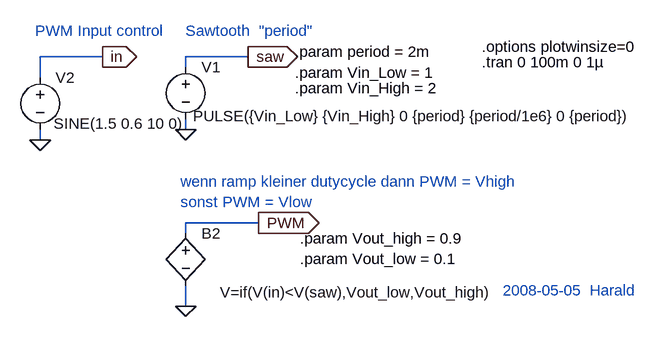
[diagram p0: schematic pwm_idea.asc]
pwm_idea.asc, the LTspice schematic file:
Version 4
SHEET 1 1276 680
WIRE -896 -320 -992 -320
WIRE -672 -320 -768 -320
WIRE -768 -304 -768 -320
WIRE -992 -288 -992 -320
WIRE -768 -208 -768 -224
WIRE -992 -192 -992 -208
WIRE -656 -64 -768 -64
WIRE -768 -48 -768 -64
WIRE -768 64 -768 32
FLAG -768 -208 0
FLAG -672 -320 saw
IOPIN -672 -320 Out
FLAG -656 -64 PWM
IOPIN -656 -64 Out
FLAG -992 -192 0
FLAG -896 -320 in
IOPIN -896 -320 Out
FLAG -768 64 0
SYMBOL voltage -768 -320 R0
WINDOW 3 11 91 Left 0
WINDOW 123 0 0 Left 0
WINDOW 39 0 0 Left 0
SYMATTR Value PULSE({Vin_Low} {Vin_High} 0 {period} {period/1e6} 0 {period})
SYMATTR InstName V1
SYMBOL voltage -992 -304 R0
WINDOW 123 0 0 Left 0
WINDOW 39 0 0 Left 0
WINDOW 3 21 87 Left 0
SYMATTR InstName V2
SYMATTR Value SINE(1.5 0.6 10 0)
SYMBOL bv -768 -64 R0
WINDOW 3 53 107 Left 0
SYMATTR Value V=if(V(in)<V(saw),Vout_low,Vout_high)
SYMATTR InstName B2
TEXT -312 -312 Left 0 !.tran 0 100m 0 1µ
TEXT -600 -328 Left 0 !.param period = 2m
TEXT -768 -360 Left 0 ;Sawtooth  "period"
TEXT -1000 -360 Left 0 ;PWM Input control
TEXT -776 -128 Left 0 ;wenn ramp kleiner dutycycle dann PWM = Vhigh\nsonst PWM = Vlow
TEXT -312 -336 Left 0 !.options plotwinsize=0
TEXT -592 -40 Left 0 !.param Vout_high = 0.9\n.param Vout_low = 0.1
TEXT -600 -272 Left 0 !.param Vin_High = 2
TEXT -600 -296 Left 0 !.param Vin_Low = 1
TEXT -280 40 Left 0 ;2008-05-05  Harald

The netlist it stands for:
* pwm_idea.asc
V1 saw 0 PULSE({Vin_Low} {Vin_High} 0 {period} {period/1e6} 0 {period})
V2 in 0 SINE(1.5 0.6 10 0)
B2 PWM 0 V=if(V(in)<V(saw),Vout_low,Vout_high)
.tran 0 100m 0 1µ
.param period = 2m
* Sawtooth  "period"
* PWM Input control
* wenn ramp kleiner dutycycle dann PWM = Vhigh
* sonst PWM = Vlow
.options plotwinsize=0
.param Vout_high = 0.9
.param Vout_low = 0.1
.param Vin_High = 2
.param Vin_Low = 1
* 2008-05-05  Harald
.backanno
.end